# EAGLE board Proto Business Card (EAGLE 7.3.0)
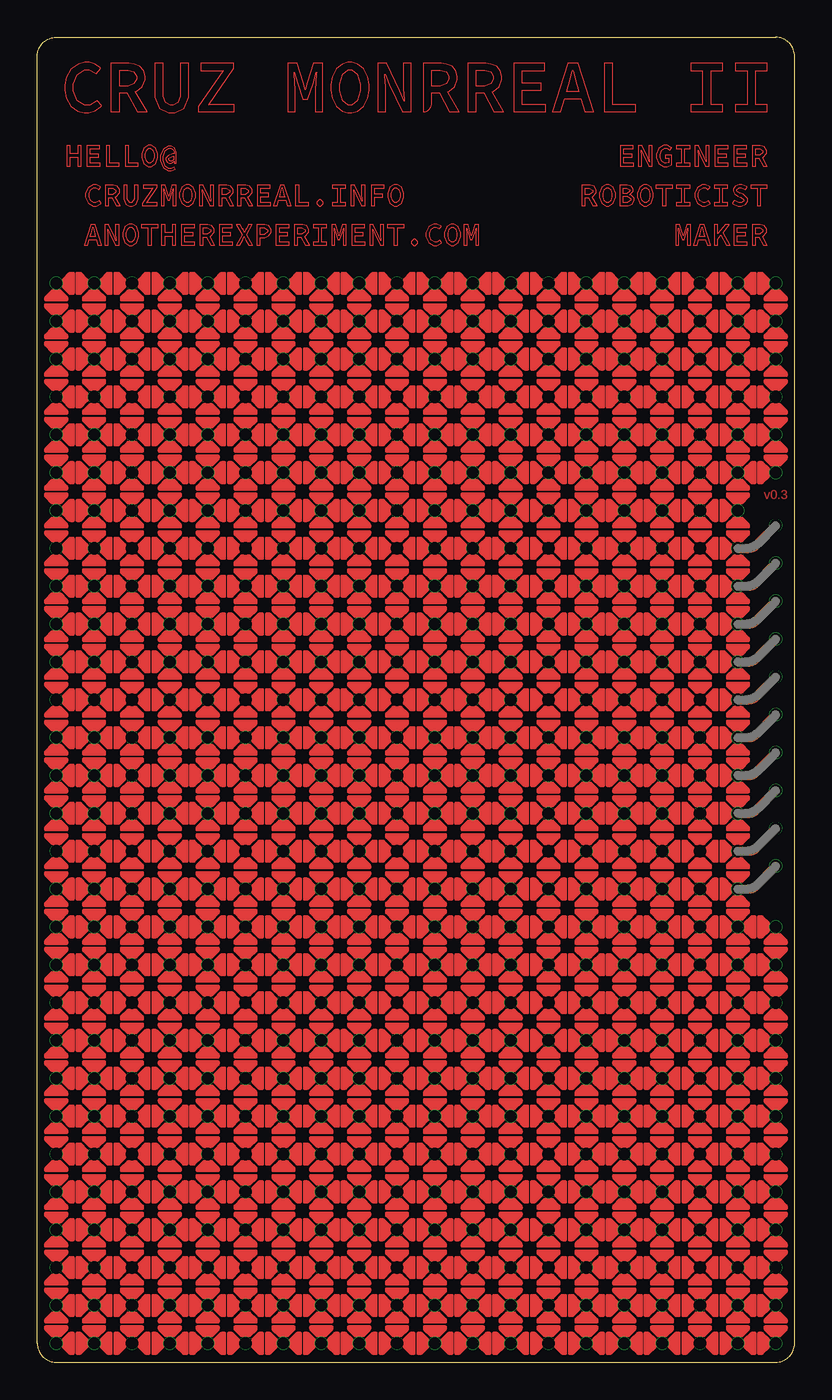
[diagram p1: board, top side]
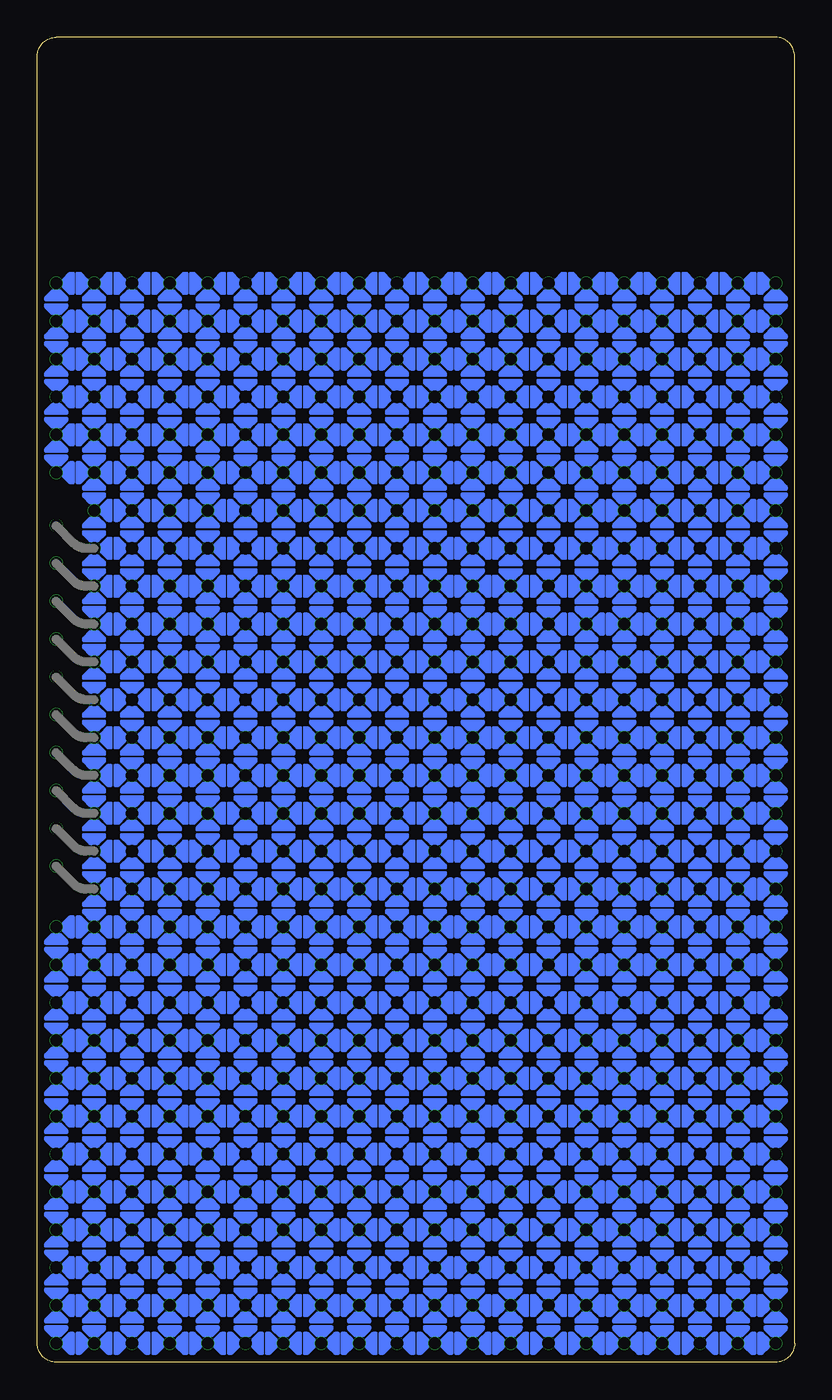
[diagram p2: board, bottom side, seen from below]

Size 50.8 x 88.9 mm. Coordinates in mm from the lower left corner, seen from the top.
Outline: 0,1.27 arc90 1.27,0 49.53,0 arc90 50.8,1.27 50.8,87.63 arc90 49.53,88.9 1.27,88.9 arc90 0,87.63 0,1.27
Copper layers (1*16): Top 0.0356mm / dielectric 1.5011mm / Bottom 0.0356mm
Design rules "OSHPark *": minimum track width 6mil, minimum drill 13mil, track to track 6mil, track to pad 6mil, pad to pad 6mil, via to via 6mil, smd to smd 6mil, copper to edge 15mil, drill to drill 6mil, minimum pad ring 0mil, minimum via ring 0mil, stop-mask expansion 4mil, vias tented up to drill 16mil, thermal gap 10mil

## Footprints (pad centres in the part's own frame; a part is rotated, then mirrored left to right if it is on the bottom)
2-2.CORNER = drill 0.813 pad 0.864: VIA 0,0
3-3 = drill 0.813 pad 0.864: VIA 0,0
4-4 = drill 0.813 pad 0.864: VIA 0,0
NONE = drill 0.813 pad 0.864: VIA 0,0

## Placement (x,y rotation side)
U$1  VIA.2-2.CORNER  [2-2.CORNER]  49.53,72.39 90 top
U$2  VIA.3-3  [3-3]  3.81,72.39 90 top
U$3  VIA.2-2.CORNER  [2-2.CORNER]  1.27,72.39 180 top
U$4  VIA.3-3  [3-3]  1.27,69.85 180 top
U$5  VIA.3-3  [3-3]  1.27,67.31 180 top
U$6  VIA.3-3  [3-3]  1.27,64.77 180 top
U$7  VIA.3-3  [3-3]  1.27,62.23 180 top
U$8  VIA.3-3  [3-3]  1.27,59.69 180 top
U$9  VIA.3-3  [3-3]  1.27,57.15 180 top
U$10  VIA.3-3  [3-3]  1.27,54.61 180 top
U$11  VIA.3-3  [3-3]  1.27,52.07 180 top
U$12  VIA.3-3  [3-3]  1.27,49.53 180 top
U$13  VIA.3-3  [3-3]  1.27,46.99 180 top
U$14  VIA.3-3  [3-3]  1.27,44.45 180 top
U$15  VIA.3-3  [3-3]  1.27,41.91 180 top
U$16  VIA.3-3  [3-3]  1.27,39.37 180 top
U$17  VIA.3-3  [3-3]  1.27,36.83 180 top
U$18  VIA.3-3  [3-3]  1.27,34.29 180 top
U$19  VIA.3-3  [3-3]  1.27,31.75 180 top
U$20  VIA.3-3  [3-3]  49.53,26.67 0 top
U$21  VIA.2-2.CORNER  [2-2.CORNER]  49.53,29.21 90 top
U$22  VIA.3-3  [3-3]  49.53,21.59 0 top
U$23  VIA.3-3  [3-3]  49.53,24.13 0 top
U$24  VIA.3-3  [3-3]  49.53,16.51 0 top
U$25  VIA.3-3  [3-3]  49.53,19.05 0 top
U$26  VIA.3-3  [3-3]  1.27,29.21 180 top
U$27  VIA.3-3  [3-3]  1.27,26.67 180 top
U$28  VIA.3-3  [3-3]  1.27,24.13 180 top
U$29  VIA.3-3  [3-3]  1.27,21.59 180 top
U$30  VIA.3-3  [3-3]  1.27,19.05 180 top
U$31  VIA.3-3  [3-3]  1.27,16.51 180 top
U$32  VIA.3-3  [3-3]  1.27,13.97 180 top
U$33  VIA.3-3  [3-3]  1.27,11.43 180 top
U$34  VIA.3-3  [3-3]  1.27,8.89 180 top
U$35  VIA.3-3  [3-3]  1.27,6.35 180 top
U$36  VIA.3-3  [3-3]  1.27,3.81 180 top
U$37  VIA.2-2.CORNER  [2-2.CORNER]  1.27,1.27 270 top
U$38  VIA.4-4  [4-4]  3.81,69.85 0 top
U$39  VIA.4-4  [4-4]  3.81,67.31 0 top
U$40  VIA.4-4  [4-4]  3.81,64.77 0 top
U$41  VIA.4-4  [4-4]  3.81,62.23 0 top
U$42  VIA.4-4  [4-4]  3.81,59.69 0 top
U$43  VIA.4-4  [4-4]  3.81,57.15 0 top
U$44  VIA.4-4  [4-4]  3.81,54.61 0 top
U$45  VIA.3-3  [3-3]  49.53,11.43 0 top
U$46  VIA.3-3  [3-3]  49.53,13.97 0 top
U$47  VIA.4-4  [4-4]  46.99,26.67 0 top
U$48  VIA.4-4  [4-4]  46.99,29.21 0 top
U$49  VIA.4-4  [4-4]  46.99,21.59 0 top
U$50  VIA.4-4  [4-4]  46.99,24.13 0 top
U$51  VIA.4-4  [4-4]  3.81,52.07 0 top
U$52  VIA.4-4  [4-4]  3.81,49.53 0 top
U$53  VIA.4-4  [4-4]  3.81,46.99 0 top
U$54  VIA.4-4  [4-4]  3.81,44.45 0 top
U$55  VIA.4-4  [4-4]  3.81,41.91 0 top
U$56  VIA.4-4  [4-4]  3.81,39.37 0 top
U$57  VIA.4-4  [4-4]  3.81,36.83 0 top
U$58  VIA.4-4  [4-4]  3.81,34.29 0 top
U$59  VIA.4-4  [4-4]  3.81,31.75 0 top
U$60  VIA.4-4  [4-4]  3.81,29.21 0 top
U$61  VIA.4-4  [4-4]  3.81,26.67 0 top
U$62  VIA.4-4  [4-4]  3.81,24.13 0 top
U$63  VIA.4-4  [4-4]  3.81,21.59 0 top
U$64  VIA.4-4  [4-4]  3.81,19.05 0 top
U$65  VIA.4-4  [4-4]  3.81,16.51 0 top
U$66  VIA.4-4  [4-4]  3.81,13.97 0 top
U$67  VIA.4-4  [4-4]  3.81,11.43 0 top
U$68  VIA.4-4  [4-4]  3.81,8.89 0 top
U$69  VIA.4-4  [4-4]  3.81,6.35 0 top
U$70  VIA.4-4  [4-4]  46.99,16.51 0 top
U$71  VIA.4-4  [4-4]  46.99,19.05 0 top
U$72  VIA.4-4  [4-4]  46.99,11.43 0 top
U$73  VIA.4-4  [4-4]  46.99,13.97 0 top
U$74  VIA.NONE  [NONE]  49.53,48.53 0 top
U$75  VIA.NONE  [NONE]  49.53,51.07 0 top
U$76  VIA.4-4  [4-4]  3.81,3.81 0 top
U$77  VIA.3-3  [3-3]  3.81,1.27 270 top
U$78  VIA.3-3  [3-3]  6.35,72.39 90 top
U$79  VIA.4-4  [4-4]  6.35,69.85 0 top
U$80  VIA.4-4  [4-4]  6.35,67.31 0 top
U$81  VIA.4-4  [4-4]  6.35,64.77 0 top
U$82  VIA.4-4  [4-4]  6.35,62.23 0 top
U$83  VIA.4-4  [4-4]  6.35,59.69 0 top
U$84  VIA.4-4  [4-4]  6.35,57.15 0 top
U$85  VIA.4-4  [4-4]  6.35,54.61 0 top
U$86  VIA.4-4  [4-4]  6.35,52.07 0 top
U$87  VIA.4-4  [4-4]  6.35,49.53 0 top
U$88  VIA.4-4  [4-4]  6.35,46.99 0 top
U$89  VIA.4-4  [4-4]  6.35,44.45 0 top
U$90  VIA.4-4  [4-4]  6.35,41.91 0 top
U$91  VIA.4-4  [4-4]  6.35,39.37 0 top
U$92  VIA.4-4  [4-4]  6.35,36.83 0 top
U$93  VIA.4-4  [4-4]  6.35,34.29 0 top
U$94  VIA.4-4  [4-4]  6.35,31.75 0 top
U$95  VIA.NONE  [NONE]  49.53,43.45 0 top
U$96  VIA.NONE  [NONE]  49.53,45.99 0 top
U$97  VIA.NONE  [NONE]  49.53,38.37 0 top
U$98  VIA.NONE  [NONE]  49.53,40.91 0 top
U$99  VIA.NONE  [NONE]  49.53,33.29 0 top
U$100  VIA.NONE  [NONE]  49.53,35.83 0 top
U$101  VIA.4-4  [4-4]  6.35,29.21 0 top
U$102  VIA.4-4  [4-4]  6.35,26.67 0 top
U$103  VIA.4-4  [4-4]  6.35,24.13 0 top
U$104  VIA.4-4  [4-4]  6.35,21.59 0 top
U$105  VIA.4-4  [4-4]  6.35,19.05 0 top
U$106  VIA.4-4  [4-4]  6.35,16.51 0 top
U$107  VIA.4-4  [4-4]  6.35,13.97 0 top
U$108  VIA.4-4  [4-4]  6.35,11.43 0 top
U$109  VIA.4-4  [4-4]  6.35,8.89 0 top
U$110  VIA.4-4  [4-4]  6.35,6.35 0 top
U$111  VIA.4-4  [4-4]  6.35,3.81 0 top
U$112  VIA.3-3  [3-3]  6.35,1.27 270 top
U$113  VIA.3-3  [3-3]  8.89,72.39 90 top
U$114  VIA.4-4  [4-4]  8.89,69.85 0 top
U$115  VIA.4-4  [4-4]  8.89,67.31 0 top
U$116  VIA.4-4  [4-4]  8.89,64.77 0 top
U$117  VIA.4-4  [4-4]  8.89,62.23 0 top
U$118  VIA.4-4  [4-4]  8.89,59.69 0 top
U$119  VIA.4-4  [4-4]  8.89,57.15 0 top
U$120  VIA.3-3  [3-3]  46.99,46.99 0 top
U$121  VIA.3-3  [3-3]  46.99,49.53 0 top
U$122  VIA.3-3  [3-3]  46.99,41.91 0 top
U$123  VIA.3-3  [3-3]  46.99,44.45 0 top
U$124  VIA.3-3  [3-3]  46.99,36.83 0 top
U$125  VIA.3-3  [3-3]  46.99,39.37 0 top
U$126  VIA.4-4  [4-4]  8.89,54.61 0 top
U$127  VIA.4-4  [4-4]  8.89,52.07 0 top
U$128  VIA.4-4  [4-4]  8.89,49.53 0 top
U$129  VIA.4-4  [4-4]  8.89,46.99 0 top
U$130  VIA.4-4  [4-4]  8.89,44.45 0 top
U$131  VIA.4-4  [4-4]  8.89,41.91 0 top
U$132  VIA.4-4  [4-4]  8.89,39.37 0 top
U$133  VIA.4-4  [4-4]  8.89,36.83 0 top
U$134  VIA.4-4  [4-4]  8.89,34.29 0 top
U$135  VIA.4-4  [4-4]  8.89,31.75 0 top
U$136  VIA.4-4  [4-4]  8.89,29.21 0 top
U$137  VIA.4-4  [4-4]  8.89,26.67 0 top
U$138  VIA.4-4  [4-4]  8.89,24.13 0 top
U$139  VIA.4-4  [4-4]  8.89,21.59 0 top
U$140  VIA.4-4  [4-4]  8.89,19.05 0 top
U$141  VIA.4-4  [4-4]  8.89,16.51 0 top
U$142  VIA.4-4  [4-4]  8.89,13.97 0 top
U$143  VIA.4-4  [4-4]  8.89,11.43 0 top
U$144  VIA.4-4  [4-4]  8.89,8.89 0 top
U$145  VIA.3-3  [3-3]  46.99,31.75 0 top
U$146  VIA.3-3  [3-3]  46.99,34.29 0 top
U$147  VIA.4-4  [4-4]  8.89,6.35 0 top
U$148  VIA.NONE  [NONE]  49.53,53.61 0 top
U$149  VIA.NONE  [NONE]  49.53,56.15 0 top
U$150  VIA.3-3  [3-3]  46.99,52.07 0 top
U$151  VIA.4-4  [4-4]  8.89,3.81 0 top
U$152  VIA.3-3  [3-3]  8.89,1.27 270 top
U$153  VIA.3-3  [3-3]  11.43,72.39 90 top
U$154  VIA.4-4  [4-4]  11.43,69.85 0 top
U$155  VIA.4-4  [4-4]  11.43,67.31 0 top
U$156  VIA.4-4  [4-4]  11.43,64.77 0 top
U$157  VIA.4-4  [4-4]  11.43,62.23 0 top
U$158  VIA.4-4  [4-4]  11.43,59.69 0 top
U$159  VIA.4-4  [4-4]  11.43,57.15 0 top
U$160  VIA.4-4  [4-4]  11.43,54.61 0 top
U$161  VIA.4-4  [4-4]  11.43,52.07 0 top
U$162  VIA.4-4  [4-4]  11.43,49.53 0 top
U$163  VIA.4-4  [4-4]  11.43,46.99 0 top
U$164  VIA.4-4  [4-4]  11.43,44.45 0 top
U$165  VIA.4-4  [4-4]  11.43,41.91 0 top
U$166  VIA.4-4  [4-4]  11.43,39.37 0 top
U$167  VIA.4-4  [4-4]  11.43,36.83 0 top
U$168  VIA.4-4  [4-4]  11.43,34.29 0 top
U$169  VIA.4-4  [4-4]  11.43,31.75 0 top
U$170  VIA.3-3  [3-3]  46.99,54.61 0 top
U$171  VIA.4-4  [4-4]  11.43,29.21 0 top
U$172  VIA.4-4  [4-4]  11.43,26.67 0 top
U$173  VIA.4-4  [4-4]  11.43,24.13 0 top
U$174  VIA.4-4  [4-4]  11.43,21.59 0 top
U$175  VIA.4-4  [4-4]  11.43,19.05 0 top
U$176  VIA.4-4  [4-4]  11.43,16.51 0 top
U$177  VIA.4-4  [4-4]  11.43,13.97 0 top
U$178  VIA.4-4  [4-4]  11.43,11.43 0 top
U$179  VIA.4-4  [4-4]  11.43,8.89 0 top
U$180  VIA.4-4  [4-4]  11.43,6.35 0 top
U$181  VIA.4-4  [4-4]  11.43,3.81 0 top
U$182  VIA.3-3  [3-3]  11.43,1.27 270 top
U$183  VIA.3-3  [3-3]  13.97,72.39 90 top
U$184  VIA.4-4  [4-4]  13.97,69.85 0 top
U$185  VIA.4-4  [4-4]  13.97,67.31 0 top
U$186  VIA.4-4  [4-4]  13.97,64.77 0 top
U$187  VIA.4-4  [4-4]  13.97,62.23 0 top
U$188  VIA.4-4  [4-4]  13.97,59.69 0 top
U$189  VIA.4-4  [4-4]  13.97,57.15 0 top
U$190  VIA.4-4  [4-4]  13.97,54.61 0 top
U$191  VIA.4-4  [4-4]  13.97,52.07 0 top
U$192  VIA.4-4  [4-4]  13.97,49.53 0 top
U$193  VIA.4-4  [4-4]  13.97,46.99 0 top
U$194  VIA.4-4  [4-4]  13.97,44.45 0 top
U$195  VIA.4-4  [4-4]  13.97,41.91 0 top
U$196  VIA.4-4  [4-4]  13.97,39.37 0 top
U$197  VIA.4-4  [4-4]  13.97,36.83 0 top
U$198  VIA.4-4  [4-4]  13.97,34.29 0 top
U$199  VIA.4-4  [4-4]  13.97,31.75 0 top
U$200  VIA.4-4  [4-4]  13.97,29.21 0 top
U$201  VIA.4-4  [4-4]  13.97,26.67 0 top
U$202  VIA.4-4  [4-4]  13.97,24.13 0 top
U$203  VIA.4-4  [4-4]  13.97,21.59 0 top
U$204  VIA.4-4  [4-4]  13.97,19.05 0 top
U$205  VIA.4-4  [4-4]  13.97,16.51 0 top
U$206  VIA.4-4  [4-4]  13.97,13.97 0 top
U$207  VIA.4-4  [4-4]  13.97,11.43 0 top
U$208  VIA.4-4  [4-4]  13.97,8.89 0 top
U$209  VIA.4-4  [4-4]  13.97,6.35 0 top
U$210  VIA.4-4  [4-4]  13.97,3.81 0 top
U$211  VIA.3-3  [3-3]  13.97,1.27 270 top
U$212  VIA.3-3  [3-3]  16.51,72.39 90 top
U$213  VIA.4-4  [4-4]  16.51,69.85 0 top
U$214  VIA.4-4  [4-4]  16.51,67.31 0 top
U$215  VIA.4-4  [4-4]  16.51,64.77 0 top
U$216  VIA.4-4  [4-4]  16.51,62.23 0 top
U$217  VIA.4-4  [4-4]  16.51,59.69 0 top
U$218  VIA.4-4  [4-4]  16.51,57.15 0 top
U$219  VIA.4-4  [4-4]  16.51,54.61 0 top
U$220  VIA.4-4  [4-4]  16.51,52.07 0 top
U$221  VIA.4-4  [4-4]  16.51,49.53 0 top
U$222  VIA.4-4  [4-4]  16.51,46.99 0 top
U$223  VIA.4-4  [4-4]  16.51,44.45 0 top
U$224  VIA.4-4  [4-4]  16.51,41.91 0 top
U$225  VIA.4-4  [4-4]  16.51,39.37 0 top
U$226  VIA.4-4  [4-4]  16.51,36.83 0 top
U$227  VIA.4-4  [4-4]  16.51,34.29 0 top
U$228  VIA.4-4  [4-4]  16.51,31.75 0 top
U$229  VIA.4-4  [4-4]  16.51,29.21 0 top
U$230  VIA.4-4  [4-4]  16.51,26.67 0 top
U$231  VIA.4-4  [4-4]  16.51,24.13 0 top
U$232  VIA.4-4  [4-4]  16.51,21.59 0 top
U$233  VIA.4-4  [4-4]  16.51,19.05 0 top
U$234  VIA.4-4  [4-4]  16.51,16.51 0 top
U$235  VIA.4-4  [4-4]  16.51,13.97 0 top
U$236  VIA.4-4  [4-4]  16.51,11.43 0 top
U$237  VIA.4-4  [4-4]  16.51,8.89 0 top
U$238  VIA.4-4  [4-4]  16.51,6.35 0 top
U$239  VIA.4-4  [4-4]  16.51,3.81 0 top
U$240  VIA.3-3  [3-3]  16.51,1.27 270 top
U$241  VIA.3-3  [3-3]  19.05,72.39 90 top
U$242  VIA.4-4  [4-4]  19.05,69.85 0 top
U$243  VIA.4-4  [4-4]  19.05,67.31 0 top
U$244  VIA.4-4  [4-4]  19.05,64.77 0 top
U$245  VIA.4-4  [4-4]  19.05,62.23 0 top
U$246  VIA.4-4  [4-4]  19.05,59.69 0 top
U$247  VIA.4-4  [4-4]  19.05,57.15 0 top
U$248  VIA.4-4  [4-4]  19.05,54.61 0 top
U$249  VIA.4-4  [4-4]  19.05,52.07 0 top
U$250  VIA.4-4  [4-4]  19.05,49.53 0 top
U$251  VIA.4-4  [4-4]  19.05,46.99 0 top
U$252  VIA.4-4  [4-4]  19.05,44.45 0 top
U$253  VIA.4-4  [4-4]  19.05,41.91 0 top
U$254  VIA.4-4  [4-4]  19.05,39.37 0 top
U$255  VIA.4-4  [4-4]  19.05,36.83 0 top
U$256  VIA.4-4  [4-4]  19.05,34.29 0 top
U$257  VIA.4-4  [4-4]  19.05,31.75 0 top
U$258  VIA.4-4  [4-4]  19.05,29.21 0 top
U$259  VIA.4-4  [4-4]  19.05,26.67 0 top
U$260  VIA.4-4  [4-4]  19.05,24.13 0 top
U$261  VIA.4-4  [4-4]  19.05,21.59 0 top
U$262  VIA.4-4  [4-4]  19.05,19.05 0 top
U$263  VIA.4-4  [4-4]  19.05,16.51 0 top
U$264  VIA.4-4  [4-4]  19.05,13.97 0 top
U$265  VIA.4-4  [4-4]  19.05,11.43 0 top
U$266  VIA.4-4  [4-4]  19.05,8.89 0 top
U$267  VIA.4-4  [4-4]  19.05,6.35 0 top
U$268  VIA.4-4  [4-4]  19.05,3.81 0 top
U$269  VIA.3-3  [3-3]  19.05,1.27 270 top
U$270  VIA.3-3  [3-3]  21.59,72.39 90 top
U$271  VIA.4-4  [4-4]  21.59,69.85 0 top
U$272  VIA.4-4  [4-4]  21.59,67.31 0 top
U$273  VIA.4-4  [4-4]  21.59,64.77 0 top
U$274  VIA.4-4  [4-4]  21.59,62.23 0 top
U$275  VIA.4-4  [4-4]  21.59,59.69 0 top
U$276  VIA.4-4  [4-4]  21.59,57.15 0 top
U$277  VIA.4-4  [4-4]  21.59,54.61 0 top
U$278  VIA.4-4  [4-4]  21.59,52.07 0 top
U$279  VIA.4-4  [4-4]  21.59,49.53 0 top
U$280  VIA.4-4  [4-4]  21.59,46.99 0 top
U$281  VIA.4-4  [4-4]  21.59,44.45 0 top
U$282  VIA.4-4  [4-4]  21.59,41.91 0 top
U$283  VIA.4-4  [4-4]  21.59,39.37 0 top
U$284  VIA.4-4  [4-4]  21.59,36.83 0 top
U$285  VIA.4-4  [4-4]  21.59,34.29 0 top
U$286  VIA.4-4  [4-4]  21.59,31.75 0 top
U$287  VIA.4-4  [4-4]  21.59,29.21 0 top
U$288  VIA.4-4  [4-4]  21.59,26.67 0 top
U$289  VIA.4-4  [4-4]  21.59,24.13 0 top
U$290  VIA.4-4  [4-4]  21.59,21.59 0 top
U$291  VIA.4-4  [4-4]  21.59,19.05 0 top
U$292  VIA.4-4  [4-4]  21.59,16.51 0 top
U$293  VIA.4-4  [4-4]  21.59,13.97 0 top
U$294  VIA.4-4  [4-4]  21.59,11.43 0 top
U$295  VIA.4-4  [4-4]  21.59,8.89 0 top
U$296  VIA.4-4  [4-4]  21.59,6.35 0 top
U$297  VIA.4-4  [4-4]  21.59,3.81 0 top
U$298  VIA.3-3  [3-3]  21.59,1.27 270 top
U$299  VIA.3-3  [3-3]  24.13,72.39 90 top
U$300  VIA.4-4  [4-4]  24.13,69.85 0 top
U$301  VIA.4-4  [4-4]  24.13,67.31 0 top
U$302  VIA.4-4  [4-4]  24.13,64.77 0 top
U$303  VIA.4-4  [4-4]  24.13,62.23 0 top
U$304  VIA.4-4  [4-4]  24.13,59.69 0 top
U$305  VIA.4-4  [4-4]  24.13,57.15 0 top
U$306  VIA.4-4  [4-4]  24.13,54.61 0 top
U$307  VIA.4-4  [4-4]  24.13,52.07 0 top
U$308  VIA.4-4  [4-4]  24.13,49.53 0 top
U$309  VIA.4-4  [4-4]  24.13,46.99 0 top
U$310  VIA.4-4  [4-4]  24.13,44.45 0 top
U$311  VIA.4-4  [4-4]  24.13,41.91 0 top
U$312  VIA.4-4  [4-4]  24.13,39.37 0 top
U$313  VIA.4-4  [4-4]  24.13,36.83 0 top
U$314  VIA.4-4  [4-4]  24.13,34.29 0 top
U$315  VIA.4-4  [4-4]  24.13,31.75 0 top
U$316  VIA.4-4  [4-4]  24.13,29.21 0 top
U$317  VIA.4-4  [4-4]  24.13,26.67 0 top
U$318  VIA.4-4  [4-4]  24.13,24.13 0 top
U$319  VIA.4-4  [4-4]  24.13,21.59 0 top
U$320  VIA.4-4  [4-4]  24.13,19.05 0 top
U$321  VIA.4-4  [4-4]  24.13,16.51 0 top
U$322  VIA.4-4  [4-4]  24.13,13.97 0 top
U$323  VIA.4-4  [4-4]  24.13,11.43 0 top
U$324  VIA.4-4  [4-4]  24.13,8.89 0 top
U$325  VIA.4-4  [4-4]  24.13,6.35 0 top
U$326  VIA.4-4  [4-4]  24.13,3.81 0 top
U$327  VIA.3-3  [3-3]  24.13,1.27 270 top
U$328  VIA.3-3  [3-3]  26.67,72.39 90 top
U$329  VIA.4-4  [4-4]  26.67,69.85 0 top
U$330  VIA.4-4  [4-4]  26.67,67.31 0 top
U$331  VIA.4-4  [4-4]  26.67,64.77 0 top
U$332  VIA.4-4  [4-4]  26.67,62.23 0 top
U$333  VIA.4-4  [4-4]  26.67,59.69 0 top
U$334  VIA.4-4  [4-4]  26.67,57.15 0 top
U$335  VIA.4-4  [4-4]  26.67,54.61 0 top
U$336  VIA.4-4  [4-4]  26.67,52.07 0 top
U$337  VIA.4-4  [4-4]  26.67,49.53 0 top
U$338  VIA.4-4  [4-4]  26.67,46.99 0 top
U$339  VIA.4-4  [4-4]  26.67,44.45 0 top
U$340  VIA.4-4  [4-4]  26.67,41.91 0 top
U$341  VIA.4-4  [4-4]  26.67,39.37 0 top
U$342  VIA.4-4  [4-4]  26.67,36.83 0 top
U$343  VIA.4-4  [4-4]  26.67,34.29 0 top
U$344  VIA.4-4  [4-4]  26.67,31.75 0 top
U$345  VIA.4-4  [4-4]  26.67,29.21 0 top
U$346  VIA.4-4  [4-4]  26.67,26.67 0 top
U$347  VIA.4-4  [4-4]  26.67,24.13 0 top
U$348  VIA.4-4  [4-4]  26.67,21.59 0 top
U$349  VIA.4-4  [4-4]  26.67,19.05 0 top
U$350  VIA.4-4  [4-4]  26.67,16.51 0 top
U$351  VIA.4-4  [4-4]  26.67,13.97 0 top
U$352  VIA.4-4  [4-4]  26.67,11.43 0 top
U$353  VIA.4-4  [4-4]  26.67,8.89 0 top
U$354  VIA.4-4  [4-4]  26.67,6.35 0 top
U$355  VIA.4-4  [4-4]  26.67,3.81 0 top
U$356  VIA.3-3  [3-3]  26.67,1.27 270 top
U$357  VIA.3-3  [3-3]  29.21,72.39 90 top
U$358  VIA.4-4  [4-4]  29.21,69.85 0 top
U$359  VIA.4-4  [4-4]  29.21,67.31 0 top
U$360  VIA.4-4  [4-4]  29.21,64.77 0 top
U$361  VIA.4-4  [4-4]  29.21,62.23 0 top
U$362  VIA.4-4  [4-4]  29.21,59.69 0 top
U$363  VIA.4-4  [4-4]  29.21,57.15 0 top
U$364  VIA.4-4  [4-4]  29.21,54.61 0 top
U$365  VIA.4-4  [4-4]  29.21,52.07 0 top
U$366  VIA.4-4  [4-4]  29.21,49.53 0 top
U$367  VIA.4-4  [4-4]  29.21,46.99 0 top
U$368  VIA.4-4  [4-4]  29.21,44.45 0 top
U$369  VIA.4-4  [4-4]  29.21,41.91 0 top
U$370  VIA.4-4  [4-4]  29.21,39.37 0 top
U$371  VIA.4-4  [4-4]  29.21,36.83 0 top
U$372  VIA.4-4  [4-4]  29.21,34.29 0 top
U$373  VIA.4-4  [4-4]  29.21,31.75 0 top
U$374  VIA.4-4  [4-4]  29.21,29.21 0 top
U$375  VIA.4-4  [4-4]  29.21,26.67 0 top
U$376  VIA.4-4  [4-4]  29.21,24.13 0 top
U$377  VIA.4-4  [4-4]  29.21,21.59 0 top
U$378  VIA.4-4  [4-4]  29.21,19.05 0 top
U$379  VIA.4-4  [4-4]  29.21,16.51 0 top
U$380  VIA.4-4  [4-4]  29.21,13.97 0 top
U$381  VIA.4-4  [4-4]  29.21,11.43 0 top
U$382  VIA.4-4  [4-4]  29.21,8.89 0 top
U$383  VIA.4-4  [4-4]  29.21,6.35 0 top
U$384  VIA.4-4  [4-4]  29.21,3.81 0 top
U$385  VIA.3-3  [3-3]  29.21,1.27 270 top
U$386  VIA.3-3  [3-3]  31.75,72.39 90 top
U$387  VIA.4-4  [4-4]  31.75,69.85 0 top
U$388  VIA.4-4  [4-4]  31.75,67.31 0 top
U$389  VIA.4-4  [4-4]  31.75,64.77 0 top
U$390  VIA.4-4  [4-4]  31.75,62.23 0 top
U$391  VIA.4-4  [4-4]  31.75,59.69 0 top
U$392  VIA.4-4  [4-4]  31.75,57.15 0 top
U$393  VIA.4-4  [4-4]  31.75,54.61 0 top
U$394  VIA.4-4  [4-4]  31.75,52.07 0 top
U$395  VIA.4-4  [4-4]  31.75,49.53 0 top
U$396  VIA.4-4  [4-4]  31.75,46.99 0 top
U$397  VIA.4-4  [4-4]  31.75,44.45 0 top
U$398  VIA.4-4  [4-4]  31.75,41.91 0 top
U$399  VIA.4-4  [4-4]  31.75,39.37 0 top
U$400  VIA.4-4  [4-4]  31.75,36.83 0 top
U$401  VIA.4-4  [4-4]  31.75,34.29 0 top
U$402  VIA.4-4  [4-4]  31.75,31.75 0 top
U$403  VIA.4-4  [4-4]  31.75,29.21 0 top
U$404  VIA.4-4  [4-4]  31.75,26.67 0 top
U$405  VIA.4-4  [4-4]  31.75,24.13 0 top
U$406  VIA.4-4  [4-4]  31.75,21.59 0 top
U$407  VIA.4-4  [4-4]  31.75,19.05 0 top
U$408  VIA.4-4  [4-4]  31.75,16.51 0 top
U$409  VIA.4-4  [4-4]  31.75,13.97 0 top
U$410  VIA.4-4  [4-4]  31.75,11.43 0 top
U$411  VIA.4-4  [4-4]  31.75,8.89 0 top
U$412  VIA.4-4  [4-4]  31.75,6.35 0 top
U$413  VIA.4-4  [4-4]  31.75,3.81 0 top
U$414  VIA.3-3  [3-3]  31.75,1.27 270 top
U$415  VIA.3-3  [3-3]  34.29,72.39 90 top
U$416  VIA.4-4  [4-4]  34.29,69.85 0 top
U$417  VIA.4-4  [4-4]  34.29,67.31 0 top
U$418  VIA.4-4  [4-4]  34.29,64.77 0 top
U$419  VIA.4-4  [4-4]  34.29,62.23 0 top
U$420  VIA.4-4  [4-4]  34.29,59.69 0 top
U$421  VIA.4-4  [4-4]  34.29,57.15 0 top
U$422  VIA.4-4  [4-4]  34.29,54.61 0 top
U$423  VIA.4-4  [4-4]  34.29,52.07 0 top
U$424  VIA.4-4  [4-4]  34.29,49.53 0 top
U$425  VIA.4-4  [4-4]  34.29,46.99 0 top
U$426  VIA.4-4  [4-4]  34.29,44.45 0 top
U$427  VIA.4-4  [4-4]  34.29,41.91 0 top
U$428  VIA.4-4  [4-4]  34.29,39.37 0 top
U$429  VIA.4-4  [4-4]  34.29,36.83 0 top
U$430  VIA.4-4  [4-4]  34.29,34.29 0 top
U$431  VIA.4-4  [4-4]  34.29,31.75 0 top
U$432  VIA.4-4  [4-4]  34.29,29.21 0 top
U$433  VIA.4-4  [4-4]  34.29,26.67 0 top
U$434  VIA.4-4  [4-4]  34.29,24.13 0 top
U$435  VIA.4-4  [4-4]  34.29,21.59 0 top
U$436  VIA.4-4  [4-4]  34.29,19.05 0 top
U$437  VIA.4-4  [4-4]  34.29,16.51 0 top
U$438  VIA.4-4  [4-4]  34.29,13.97 0 top
U$439  VIA.4-4  [4-4]  34.29,11.43 0 top
U$440  VIA.4-4  [4-4]  34.29,8.89 0 top
U$441  VIA.4-4  [4-4]  34.29,6.35 0 top
U$442  VIA.4-4  [4-4]  34.29,3.81 0 top
U$443  VIA.3-3  [3-3]  34.29,1.27 270 top
U$444  VIA.3-3  [3-3]  36.83,72.39 90 top
U$445  VIA.4-4  [4-4]  36.83,69.85 0 top
U$446  VIA.4-4  [4-4]  36.83,67.31 0 top
U$447  VIA.4-4  [4-4]  36.83,64.77 0 top
U$448  VIA.4-4  [4-4]  36.83,62.23 0 top
U$449  VIA.4-4  [4-4]  36.83,59.69 0 top
U$450  VIA.4-4  [4-4]  36.83,57.15 0 top
U$451  VIA.4-4  [4-4]  36.83,54.61 0 top
U$452  VIA.4-4  [4-4]  36.83,52.07 0 top
U$453  VIA.4-4  [4-4]  36.83,49.53 0 top
U$454  VIA.4-4  [4-4]  36.83,46.99 0 top
U$455  VIA.4-4  [4-4]  36.83,44.45 0 top
U$456  VIA.4-4  [4-4]  36.83,41.91 0 top
U$457  VIA.4-4  [4-4]  36.83,39.37 0 top
U$458  VIA.4-4  [4-4]  36.83,36.83 0 top
U$459  VIA.4-4  [4-4]  36.83,34.29 0 top
U$460  VIA.4-4  [4-4]  36.83,31.75 0 top
U$461  VIA.4-4  [4-4]  36.83,29.21 0 top
U$462  VIA.4-4  [4-4]  36.83,26.67 0 top
U$463  VIA.4-4  [4-4]  36.83,24.13 0 top
U$464  VIA.4-4  [4-4]  36.83,21.59 0 top
U$465  VIA.4-4  [4-4]  36.83,19.05 0 top
U$466  VIA.4-4  [4-4]  36.83,16.51 0 top
U$467  VIA.4-4  [4-4]  36.83,13.97 0 top
U$468  VIA.4-4  [4-4]  36.83,11.43 0 top
U$469  VIA.4-4  [4-4]  36.83,8.89 0 top
U$470  VIA.4-4  [4-4]  36.83,6.35 0 top
U$471  VIA.4-4  [4-4]  36.83,3.81 0 top
U$472  VIA.3-3  [3-3]  36.83,1.27 270 top
U$473  VIA.3-3  [3-3]  39.37,72.39 90 top
U$474  VIA.4-4  [4-4]  39.37,69.85 0 top
U$475  VIA.4-4  [4-4]  39.37,67.31 0 top
U$476  VIA.4-4  [4-4]  39.37,64.77 0 top
U$477  VIA.4-4  [4-4]  39.37,62.23 0 top
U$478  VIA.4-4  [4-4]  39.37,59.69 0 top
U$479  VIA.4-4  [4-4]  39.37,57.15 0 top
U$480  VIA.4-4  [4-4]  39.37,54.61 0 top
U$481  VIA.4-4  [4-4]  39.37,52.07 0 top
U$482  VIA.4-4  [4-4]  39.37,49.53 0 top
U$483  VIA.4-4  [4-4]  39.37,46.99 0 top
U$484  VIA.4-4  [4-4]  39.37,44.45 0 top
U$485  VIA.4-4  [4-4]  39.37,41.91 0 top
U$486  VIA.4-4  [4-4]  39.37,39.37 0 top
U$487  VIA.4-4  [4-4]  39.37,36.83 0 top
U$488  VIA.4-4  [4-4]  39.37,34.29 0 top
U$489  VIA.4-4  [4-4]  39.37,31.75 0 top
U$490  VIA.4-4  [4-4]  39.37,29.21 0 top
U$491  VIA.4-4  [4-4]  39.37,26.67 0 top
U$492  VIA.4-4  [4-4]  39.37,24.13 0 top
U$493  VIA.4-4  [4-4]  39.37,21.59 0 top
U$494  VIA.4-4  [4-4]  39.37,19.05 0 top
U$495  VIA.4-4  [4-4]  39.37,16.51 0 top
U$496  VIA.4-4  [4-4]  39.37,13.97 0 top
U$497  VIA.4-4  [4-4]  39.37,11.43 0 top
U$498  VIA.4-4  [4-4]  39.37,8.89 0 top
U$499  VIA.4-4  [4-4]  39.37,6.35 0 top
U$500  VIA.4-4  [4-4]  39.37,3.81 0 top
U$501  VIA.3-3  [3-3]  39.37,1.27 270 top
U$502  VIA.3-3  [3-3]  41.91,72.39 90 top
U$503  VIA.4-4  [4-4]  41.91,69.85 0 top
U$504  VIA.4-4  [4-4]  41.91,67.31 0 top
U$505  VIA.4-4  [4-4]  41.91,64.77 0 top
U$506  VIA.4-4  [4-4]  41.91,62.23 0 top
U$507  VIA.4-4  [4-4]  41.91,59.69 0 top
U$508  VIA.4-4  [4-4]  41.91,57.15 0 top
U$509  VIA.4-4  [4-4]  41.91,54.61 0 top
U$510  VIA.4-4  [4-4]  41.91,52.07 0 top
U$511  VIA.4-4  [4-4]  41.91,49.53 0 top
U$512  VIA.4-4  [4-4]  41.91,46.99 0 top
U$513  VIA.4-4  [4-4]  41.91,44.45 0 top
U$514  VIA.4-4  [4-4]  41.91,41.91 0 top
U$515  VIA.4-4  [4-4]  41.91,39.37 0 top
U$516  VIA.4-4  [4-4]  41.91,36.83 0 top
U$517  VIA.4-4  [4-4]  41.91,34.29 0 top
U$518  VIA.4-4  [4-4]  41.91,31.75 0 top
U$519  VIA.4-4  [4-4]  41.91,29.21 0 top
U$520  VIA.4-4  [4-4]  41.91,26.67 0 top
U$521  VIA.4-4  [4-4]  41.91,24.13 0 top
U$522  VIA.4-4  [4-4]  41.91,21.59 0 top
U$523  VIA.4-4  [4-4]  41.91,19.05 0 top
U$524  VIA.4-4  [4-4]  41.91,16.51 0 top
U$525  VIA.4-4  [4-4]  41.91,13.97 0 top
U$526  VIA.4-4  [4-4]  41.91,11.43 0 top
U$527  VIA.4-4  [4-4]  41.91,8.89 0 top
U$528  VIA.4-4  [4-4]  41.91,6.35 0 top
U$529  VIA.4-4  [4-4]  41.91,3.81 0 top
U$530  VIA.3-3  [3-3]  41.91,1.27 270 top
U$531  VIA.3-3  [3-3]  44.45,72.39 90 top
U$532  VIA.4-4  [4-4]  44.45,69.85 0 top
U$533  VIA.4-4  [4-4]  44.45,67.31 0 top
U$534  VIA.4-4  [4-4]  44.45,64.77 0 top
U$535  VIA.4-4  [4-4]  44.45,62.23 0 top
U$536  VIA.4-4  [4-4]  44.45,59.69 0 top
U$537  VIA.4-4  [4-4]  44.45,57.15 0 top
U$538  VIA.4-4  [4-4]  44.45,54.61 0 top
U$539  VIA.4-4  [4-4]  44.45,52.07 0 top
U$540  VIA.4-4  [4-4]  44.45,49.53 0 top
U$541  VIA.4-4  [4-4]  44.45,46.99 0 top
U$542  VIA.4-4  [4-4]  44.45,44.45 0 top
U$543  VIA.4-4  [4-4]  44.45,41.91 0 top
U$544  VIA.4-4  [4-4]  44.45,39.37 0 top
U$545  VIA.4-4  [4-4]  44.45,36.83 0 top
U$546  VIA.4-4  [4-4]  44.45,34.29 0 top
U$547  VIA.4-4  [4-4]  44.45,31.75 0 top
U$548  VIA.4-4  [4-4]  44.45,29.21 0 top
U$549  VIA.4-4  [4-4]  44.45,26.67 0 top
U$550  VIA.4-4  [4-4]  44.45,24.13 0 top
U$551  VIA.4-4  [4-4]  44.45,21.59 0 top
U$552  VIA.4-4  [4-4]  44.45,19.05 0 top
U$553  VIA.4-4  [4-4]  44.45,16.51 0 top
U$554  VIA.4-4  [4-4]  44.45,13.97 0 top
U$555  VIA.4-4  [4-4]  44.45,11.43 0 top
U$556  VIA.4-4  [4-4]  44.45,8.89 0 top
U$557  VIA.4-4  [4-4]  44.45,6.35 0 top
U$558  VIA.4-4  [4-4]  44.45,3.81 0 top
U$559  VIA.3-3  [3-3]  44.45,1.27 270 top
U$560  VIA.3-3  [3-3]  46.99,72.39 90 top
U$561  VIA.4-4  [4-4]  46.99,69.85 0 top
U$562  VIA.4-4  [4-4]  46.99,67.31 0 top
U$563  VIA.4-4  [4-4]  46.99,64.77 0 top
U$564  VIA.4-4  [4-4]  46.99,62.23 0 top
U$565  VIA.4-4  [4-4]  46.99,59.69 0 top
U$566  VIA.3-3  [3-3]  49.53,69.85 0 top
U$567  VIA.3-3  [3-3]  49.53,67.31 0 top
U$568  VIA.3-3  [3-3]  49.53,64.77 0 top
U$569  VIA.3-3  [3-3]  49.53,62.23 0 top
U$570  VIA.2-2.CORNER  [2-2.CORNER]  49.53,59.69 0 top
U$571  VIA.3-3  [3-3]  49.53,8.89 0 top
U$572  VIA.3-3  [3-3]  49.53,6.35 0 top
U$573  VIA.3-3  [3-3]  49.53,3.81 0 top
U$574  VIA.2-2.CORNER  [2-2.CORNER]  49.53,1.27 0 top
U$575  VIA.3-3  [3-3]  46.99,57.15 0 top
U$585  VIA.4-4  [4-4]  46.99,8.89 0 top
U$586  VIA.4-4  [4-4]  46.99,6.35 0 top
U$587  VIA.4-4  [4-4]  46.99,3.81 0 top
U$588  VIA.3-3  [3-3]  46.99,1.27 270 top

## Tracks (layer width: path | path; a pad name or v marks a point on that pad's centre or on a via)
N$1
  Top 0.61: U$145.VIA 47.73,31.75 arc45 48.18,31.94 U$99.VIA
N$2
  Top 0.61: U$146.VIA 47.73,34.29 arc45 48.18,34.48 U$100.VIA
N$3
  Top 0.61: U$124.VIA 47.73,36.83 arc45 48.18,37.02 U$97.VIA
N$4
  Top 0.61: U$125.VIA 47.73,39.37 arc45 48.18,39.56 U$98.VIA
N$5
  Top 0.61: U$122.VIA 47.73,41.91 arc45 48.18,42.1 U$95.VIA
N$6
  Top 0.61: U$123.VIA 47.73,44.45 arc45 48.18,44.64 U$96.VIA
N$7
  Top 0.61: U$120.VIA 47.73,46.99 arc45 48.18,47.18 U$74.VIA
N$8
  Top 0.61: U$121.VIA 47.73,49.53 arc45 48.18,49.72 U$75.VIA
N$9
  Top 0.61: U$150.VIA 47.73,52.07 arc45 48.18,52.26 U$148.VIA
N$10
  Top 0.61: U$170.VIA 47.73,54.61 arc45 48.18,54.8 U$149.VIA
N$11
  Top 0.025: 3.15,83.83 3.44,83.83 3.88,83.95 4.27,84.23 4.34,84.31 4.02,84.66 3.97,84.61 3.5,84.34 3.18,84.34 2.68,84.66 2.42,85.31 2.42,85.75 2.68,86.39 3.17,86.71 3.49,86.71 3.91,86.48 3.95,86.44 4.27,86.81 4.22,86.86 3.88,87.09 3.47,87.22 3.19,87.22 2.74,87.1 2.26,86.77 1.94,86.23 1.83,85.69 1.83,85.33 1.94,84.8 2.26,84.27 2.73,83.94 3.15,83.83
N$12
  Top 0.025: 4.94,83.89 5.52,83.89 5.52,85.17 6.01,85.17 6.7,83.89 7.36,83.89 6.58,85.25 6.68,85.29 7.05,85.59 7.23,86.04 7.23,86.3 7.13,86.64 6.88,86.94 6.5,87.11 6.14,87.16 4.94,87.16 4.94,83.89
N$13
  Top 0.025: 5.52,85.63 5.52,86.69 6.09,86.69 6.48,86.58 6.66,86.28 6.66,86.08 6.48,85.77 6.09,85.63 5.52,85.63
N$14
  Top 0.025: 9.22,83.83 9.85,84.15 10.15,84.89 10.15,87.16 9.59,87.16 9.59,84.95 9.44,84.52 9.12,84.34 8.91,84.34 8.6,84.52 8.45,84.95 8.45,87.16 7.87,87.16 7.87,84.89 8.18,84.15 8.8,83.83 9.22,83.83
N$15
  Top 0.025: 10.81,83.89 13.21,83.89 13.21,84.38 11.52,84.38 13.19,86.81 13.19,87.16 10.96,87.16 10.96,86.67 12.48,86.67 10.81,84.24 10.81,83.89
N$16
  Top 0.025: 16.81,83.89 17.31,83.89 17.31,85.38 17.28,85.89 17.23,86.47 17.22,86.54 17.24,86.54 17.46,85.79 17.81,84.76 18.14,84.76 18.5,85.79 18.72,86.54 18.73,86.54 18.72,86.47 18.68,85.89 18.65,85.38 18.65,83.89 19.15,83.89 19.15,87.16 18.51,87.16 18.12,85.88 17.99,85.39 17.97,85.39 17.84,85.88 17.45,87.16 16.81,87.16 16.81,83.89
N$17
  Top 0.025: 21.1,83.83 21.49,83.94 21.9,84.28 22.16,84.81 22.25,85.36 22.25,85.72 22.16,86.25 21.9,86.78 21.49,87.11 21.1,87.22 20.84,87.22 20.45,87.11 20.05,86.78 19.78,86.25 19.69,85.72 19.69,85.36 19.78,84.81 20.05,84.28 20.45,83.94 20.84,83.83 21.1,83.83
N$18
  Top 0.025: 20.85,84.34 20.47,84.65 20.29,85.32 20.29,85.76 20.47,86.4 20.85,86.71 21.1,86.71 21.47,86.4 21.66,85.76 21.66,85.32 21.47,84.65 21.1,84.34 20.85,84.34
N$19
  Top 0.025: 22.84,83.89 23.39,83.89 23.39,85.59 23.32,86.33 23.31,86.42 23.33,86.42 23.62,85.73 24.48,83.89 25.09,83.89 25.09,87.16 24.54,87.16 24.54,85.46 24.61,84.71 24.62,84.62 24.6,84.62 24.31,85.33 23.44,87.16 22.84,87.16 22.84,83.89
N$20
  Top 0.025: 25.88,83.89 arc90 26.46,84.47 26.46,85.17 26.95,85.17 27.64,83.89 28.3,83.89 27.52,85.25 27.62,85.29 27.99,85.59 28.17,86.04 28.17,86.3 28.07,86.64 27.82,86.94 27.44,87.11 27.08,87.16 25.88,87.16 25.88,83.89
N$21
  Top 0.025: 26.46,85.63 26.46,86.69 27.03,86.69 27.42,86.58 27.6,86.28 27.6,86.08 27.42,85.77 27.03,85.63 26.46,85.63
N$22
  Top 0.025: 28.87,83.89 29.45,83.89 29.45,85.17 29.94,85.17 30.63,83.89 31.29,83.89 30.51,85.25 30.61,85.29 30.98,85.59 31.16,86.04 31.16,86.3 31.06,86.64 30.81,86.94 30.43,87.11 30.07,87.16 28.87,87.16 28.87,83.89
N$23
  Top 0.025: 29.45,85.63 29.45,86.69 30.02,86.69 30.41,86.58 30.59,86.28 30.59,86.08 30.41,85.77 30.02,85.63 29.45,85.63
N$24
  Top 0.025: 31.95,83.89 34.09,83.89 34.09,84.38 32.53,84.38 32.53,85.34 33.82,85.34 33.82,85.83 32.53,85.83 32.53,86.67 34.04,86.67 34.04,87.16 31.95,87.16 31.95,83.89
N$25
  Top 0.025: 35.62,85.63 35.64,85.71 35.89,86.61 35.91,86.7 35.93,86.7 35.95,86.61 36.19,85.71 36.22,85.63 36.33,85.23 35.51,85.23 35.62,85.63
N$26
  Top 0.025: 34.53,83.89 35.12,83.89 35.37,84.77 36.46,84.77 36.71,83.89 37.33,83.89 36.27,87.16 35.59,87.16 34.53,83.89
N$27
  Top 0.025: 38.02,83.89 40.13,83.89 40.13,84.38 38.6,84.38 38.6,87.16 38.02,87.16 38.02,83.89
N$28
  Top 0.025: 43.82,83.89 45.98,83.89 45.98,84.38 45.19,84.38 45.19,86.67 45.98,86.67 45.98,87.16 43.82,87.16 43.82,86.67 44.61,86.67 44.61,84.38 43.82,84.38 43.82,83.89
N$29
  Top 0.025: 46.81,83.89 48.97,83.89 48.97,84.38 48.18,84.38 48.18,86.67 48.97,86.67 48.97,87.16 46.81,87.16 46.81,86.67 47.6,86.67 47.6,84.38 46.81,84.38 46.81,83.89
N$30
  Top 0.025: 1.98,80.25 2.23,80.25 2.23,80.86 2.7,80.86 2.7,80.25 2.95,80.25 2.95,81.63 2.7,81.63 2.7,81.07 2.23,81.07 2.23,81.63 1.98,81.63 1.98,80.25
N$31
  Top 0.025: 3.32,80.25 4.22,80.25 4.22,80.46 3.56,80.46 3.56,80.86 4.11,80.86 4.11,81.07 3.56,81.07 3.56,81.43 4.2,81.43 4.2,81.63 3.32,81.63 3.32,80.25
N$32
  Top 0.025: 4.62,80.25 5.51,80.25 5.51,80.46 4.86,80.46 4.86,81.63 4.62,81.63 4.62,80.25
N$33
  Top 0.025: 5.89,80.25 6.78,80.25 6.78,80.46 6.13,80.46 6.13,81.63 5.89,81.63 5.89,80.25
N$34
  Top 0.025: 7.44,80.22 7.64,80.22 7.93,80.41 8.09,80.81 8.09,81.08 7.93,81.47 7.64,81.66 7.44,81.66 7.15,81.47 7,81.08 7,80.81 7.15,80.41 7.44,80.22
N$35
  Top 0.025: 7.59,80.44 7.49,80.44 7.33,80.57 7.25,80.85 7.25,81.04 7.33,81.31 7.49,81.44 7.59,81.44 7.75,81.31 7.83,81.04 7.83,80.85 7.75,80.57 7.59,80.44
N$36
  Top 0.025: 8.99,79.94 9.24,80.04 9.27,80.05 9.19,80.18 9.17,80.17 8.97,80.09 8.82,80.09 8.57,80.27 8.44,80.65 8.44,80.9 8.57,81.29 8.8,81.45 8.94,81.45 9.11,81.35 9.18,81.17 9.18,81.08 9.09,81.07 8.78,80.97 8.63,80.78 8.63,80.67 8.71,80.51 8.86,80.44 8.97,80.44 9.16,80.55 9.17,80.57 9.18,80.57 9.2,80.46 9.33,80.46 9.33,81.18 9.23,81.45 8.97,81.6 8.78,81.6 8.44,81.4 8.26,80.94 8.26,80.62 8.45,80.15 8.79,79.94 8.99,79.94
N$37
  Top 0.025: 8.92,80.59 8.82,80.69 8.82,80.78 9.1,80.92 9.16,80.93 9.16,80.7 9.14,80.69 9,80.59 8.92,80.59
N$38
  Top 0.025: 3.96,77.57 4.26,77.75 4.29,77.78 4.15,77.93 4.13,77.91 3.94,77.79 3.8,77.79 3.59,77.92 3.48,78.2 3.48,78.39 3.59,78.66 3.79,78.8 3.93,78.8 4.11,78.7 4.12,78.69 4.26,78.84 4.24,78.86 3.96,79.01 3.75,79.01 3.41,78.82 3.23,78.42 3.23,78.16 3.41,77.76 3.74,77.57 3.96,77.57
N$39
  Top 0.025: 4.54,77.6 4.79,77.6 4.79,78.14 5,78.14 5.29,77.6 5.57,77.6 5.25,78.18 5.29,78.19 5.52,78.48 5.52,78.66 5.37,78.9 5.1,78.98 4.54,78.98 4.54,77.6
N$40
  Top 0.025: 4.79,78.34 4.79,78.79 5.05,78.79 5.28,78.63 5.28,78.52 5.05,78.34 4.79,78.34
N$41
  Top 0.025: 6.37,77.57 6.63,77.71 6.76,78.03 6.76,78.98 6.52,78.98 6.52,78.03 6.34,77.79 6.22,77.79 6.03,78.03 6.03,78.98 5.79,78.98 5.79,78.03 5.92,77.71 6.19,77.57 6.37,77.57
N$42
  Top 0.025: 7.03,77.6 8.06,77.6 8.06,77.81 7.34,77.81 8.05,78.84 8.05,78.98 7.1,78.98 7.1,78.78 7.75,78.78 7.03,77.75 7.03,77.6
N$43
  Top 0.025: 8.31,77.6 8.52,77.6 8.52,78.3 8.49,78.69 8.49,78.73 8.5,78.73 8.58,78.41 8.74,77.97 8.88,77.97 9.03,78.41 9.12,78.73 9.13,78.73 9.12,78.69 9.09,78.29 9.09,77.6 9.31,77.6 9.31,78.98 9.04,78.98 8.87,78.44 8.81,78.24 8.8,78.24 8.75,78.44 8.58,78.98 8.31,78.98 8.31,77.6
N$44
  Top 0.025: 9.98,77.57 10.18,77.57 10.47,77.76 10.62,78.17 10.62,78.43 10.47,78.83 10.18,79.01 9.98,79.01 9.69,78.83 9.54,78.43 9.54,78.17 9.69,77.76 9.98,77.57
N$45
  Top 0.025: 10.13,77.79 10.03,77.79 9.87,77.92 9.79,78.21 9.79,78.39 9.87,78.67 10.03,78.8 10.13,78.8 10.29,78.67 10.37,78.39 10.37,78.21 10.29,77.92 10.13,77.79
N$46
  Top 0.025: 10.87,77.6 11.11,77.6 11.11,78.33 11.07,78.64 11.07,78.68 11.08,78.68 11.21,78.38 11.57,77.6 11.83,77.6 11.83,78.98 11.59,78.98 11.59,78.27 11.63,77.95 11.63,77.91 11.62,77.91 11.5,78.21 11.13,78.98 10.87,78.98 10.87,77.6
N$47
  Top 0.025: 12.16,77.6 12.41,77.6 12.41,78.14 12.61,78.14 12.91,77.6 13.19,77.6 12.86,78.18 12.9,78.19 13.13,78.48 13.13,78.66 12.99,78.9 12.71,78.98 12.16,78.98 12.16,77.6
N$48
  Top 0.025: 12.41,78.34 12.41,78.79 12.67,78.79 12.89,78.63 12.89,78.52 12.67,78.34 12.41,78.34
N$49
  Top 0.025: 13.43,77.6 13.68,77.6 13.68,78.14 13.88,78.14 14.18,77.6 14.45,77.6 14.13,78.18 14.17,78.19 14.4,78.48 14.4,78.66 14.26,78.9 13.98,78.98 13.43,78.98 13.43,77.6
N$50
  Top 0.025: 13.68,78.34 13.68,78.79 13.94,78.79 14.16,78.63 14.16,78.52 13.94,78.34 13.68,78.34
N$51
  Top 0.025: 14.74,77.6 15.65,77.6 15.65,77.81 14.98,77.81 14.98,78.22 15.53,78.22 15.53,78.42 14.98,78.42 14.98,78.78 15.62,78.78 15.62,78.98 14.74,78.98 14.74,77.6
N$52
  Top 0.025: 16.29,78.34 16.3,78.38 16.41,78.76 16.42,78.8 16.43,78.8 16.43,78.76 16.54,78.38 16.55,78.34 16.6,78.17 16.25,78.17 16.29,78.34
N$53
  Top 0.025: 15.84,77.6 16.08,77.6 16.19,77.98 16.65,77.98 16.76,77.6 17.02,77.6 16.57,78.98 16.28,78.98 15.84,77.6
N$54
  Top 0.025: 17.31,77.6 18.21,77.6 18.21,77.81 17.56,77.81 17.56,78.98 17.31,78.98 17.31,77.6
N$55
  Top 0.025: 19.02,77.57 19.17,77.73 19.17,77.84 19.02,78 18.91,78 18.75,77.84 18.75,77.73 18.91,77.57 19.02,77.57
N$56
  Top 0.025: 19.77,77.6 20.69,77.6 20.69,77.81 20.35,77.81 20.35,78.78 20.69,78.78 20.69,78.98 19.77,78.98 19.77,78.78 20.11,78.78 20.11,77.81 19.77,77.81 19.77,77.6
N$57
  Top 0.025: 21.02,77.6 21.26,77.6 21.26,78.33 21.23,78.64 21.23,78.68 21.36,78.38 21.72,77.6 21.98,77.6 21.98,78.98 21.74,78.98 21.74,78.27 21.78,77.95 21.78,77.91 21.77,77.91 21.65,78.21 21.28,78.98 21.02,78.98 21.02,77.6
N$58
  Top 0.025: 22.39,77.6 22.63,77.6 22.63,78.18 23.18,78.18 23.18,78.38 22.63,78.38 22.63,78.78 23.27,78.78 23.27,78.98 22.39,78.98 22.39,77.6
N$59
  Top 0.025: 23.94,77.57 24.14,77.57 24.43,77.76 24.59,78.17 24.59,78.43 24.43,78.83 24.14,79.01 23.94,79.01 23.65,78.83 23.5,78.43 23.5,78.17 23.65,77.76 23.94,77.57
N$60
  Top 0.025: 24.09,77.79 23.99,77.79 23.83,77.92 23.75,78.21 23.75,78.39 23.83,78.67 23.99,78.8 24.09,78.8 24.25,78.67 24.33,78.39 24.33,78.21 24.25,77.92 24.09,77.79
N$61
  Top 0.025: 3.6,75.69 3.61,75.73 3.72,76.11 3.73,76.15 3.74,76.11 3.85,75.73 3.85,75.69 3.9,75.52 3.56,75.52 3.6,75.69
N$62
  Top 0.025: 3.14,74.96 3.39,74.96 3.5,75.33 3.96,75.33 4.06,74.96 4.33,74.96 3.88,76.34 3.59,76.34 3.14,74.96
N$63
  Top 0.025: 4.52,74.96 4.76,74.96 4.76,75.68 4.73,75.99 4.73,76.03 4.86,75.73 5.22,74.96 5.48,74.96 5.48,76.34 5.25,76.34 5.25,75.62 5.28,75.3 5.28,75.27 5.27,75.27 5.15,75.56 4.78,76.34 4.52,76.34 4.52,74.96
N$64
  Top 0.025: 6.17,74.93 6.37,74.93 6.67,75.12 6.82,75.52 6.82,75.79 6.67,76.18 6.37,76.37 6.17,76.37 5.88,76.18 5.73,75.79 5.73,75.52 5.88,75.12 6.17,74.93
N$65
  Top 0.025: 6.32,75.14 6.22,75.14 6.06,75.28 5.98,75.56 5.98,75.75 6.06,76.02 6.22,76.15 6.32,76.15 6.48,76.02 6.56,75.75 6.56,75.56 6.48,75.28 6.32,75.14
N$66
  Top 0.025: 7.42,74.96 7.66,74.96 7.66,76.14 8.1,76.14 8.1,76.34 6.98,76.34 6.98,76.14 7.42,76.14 7.42,74.96
N$67
  Top 0.025: 8.33,74.96 8.57,74.96 8.57,75.57 9.05,75.57 9.05,74.96 9.29,74.96 9.29,76.34 9.05,76.34 9.05,75.78 8.57,75.78 8.57,76.34 8.33,76.34 8.33,74.96
N$68
  Top 0.025: 9.67,74.96 10.57,74.96 10.57,75.17 9.91,75.17 9.91,75.57 10.45,75.57 10.45,75.78 9.91,75.78 9.91,76.14 10.55,76.14 10.55,76.34 9.67,76.34 9.67,74.96
N$69
  Top 0.025: 10.89,74.96 11.14,74.96 11.14,75.5 11.34,75.5 11.64,74.96 11.92,74.96 11.59,75.53 11.63,75.55 11.87,75.84 11.87,76.01 11.72,76.25 11.45,76.34 10.89,76.34 10.89,74.96
N$70
  Top 0.025: 11.14,75.69 11.14,76.14 11.4,76.14 11.62,75.98 11.62,75.87 11.4,75.69 11.14,75.69
N$71
  Top 0.025: 12.2,74.96 13.11,74.96 13.11,75.17 12.45,75.17 12.45,75.57 12.99,75.57 12.99,75.78 12.45,75.78 12.45,76.14 13.09,76.14 13.09,76.34 12.2,76.34 12.2,74.96
N$72
  Top 0.025: 13.33,74.96 13.59,74.96 13.77,75.28 13.77,75.3 13.86,75.49 13.87,75.51 13.88,75.51 13.89,75.49 13.99,75.3 14,75.28 14.17,74.96 14.45,74.96 14.04,75.66 14.42,76.34 14.16,76.34 14,76.03 13.99,76.02 13.92,75.84 13.91,75.82 13.9,75.82 13.89,75.84 13.8,76.02 13.79,76.03 13.63,76.34 13.35,76.34 13.74,75.67 13.33,74.96
N$73
  Top 0.025: 14.71,74.96 14.95,74.96 14.95,75.46 15.26,75.46 15.54,75.57 15.69,75.83 15.69,76 15.54,76.25 15.26,76.34 14.71,76.34 14.71,74.96
N$74
  Top 0.025: 14.95,75.66 14.95,76.14 15.22,76.14 15.45,75.97 15.45,75.85 15.22,75.66 14.95,75.66
N$75
  Top 0.025: 16.01,74.96 16.91,74.96 16.91,75.17 16.25,75.17 16.25,75.57 16.8,75.57 16.8,75.78 16.25,75.78 16.25,76.14 16.89,76.14 16.89,76.34 16.01,76.34 16.01,74.96
N$76
  Top 0.025: 17.24,74.96 17.48,74.96 17.48,75.5 17.69,75.5 17.99,74.96 18.26,74.96 17.94,75.53 17.98,75.55 18.21,75.84 18.21,76.01 18.06,76.25 17.79,76.34 17.24,76.34 17.24,74.96
N$77
  Top 0.025: 17.48,75.69 17.48,76.14 17.75,76.14 17.97,75.98 17.97,75.87 17.75,75.69 17.48,75.69
N$78
  Top 0.025: 18.51,74.96 19.42,74.96 19.42,75.17 19.08,75.17 19.08,76.14 19.42,76.14 19.42,76.34 18.51,76.34 18.51,76.14 18.84,76.14 18.84,75.17 18.51,75.17 18.51,74.96
N$79
  Top 0.025: 19.74,74.96 19.95,74.96 19.95,75.65 19.92,76.05 19.91,76.08 19.92,76.08 20.01,75.76 20.16,75.32 20.3,75.32 20.45,75.76 20.55,76.08 20.55,76.05 20.51,75.65 20.51,74.96 20.73,74.96 20.73,76.34 20.46,76.34 20.29,75.8 20.24,75.59 20.23,75.59 20.17,75.8 20.01,76.34 19.74,76.34 19.74,74.96
N$80
  Top 0.025: 21.09,74.96 21.99,74.96 21.99,75.17 21.33,75.17 21.33,75.57 21.88,75.57 21.88,75.78 21.33,75.78 21.33,76.14 21.97,76.14 21.97,76.34 21.09,76.34 21.09,74.96
N$81
  Top 0.025: 22.29,74.96 22.53,74.96 22.53,75.68 22.5,75.99 22.5,76.03 22.63,75.73 22.99,74.96 23.25,74.96 23.25,76.34 23.01,76.34 23.01,75.62 23.05,75.3 23.05,75.27 23.04,75.27 22.92,75.56 22.55,76.34 22.29,76.34 22.29,74.96
N$82
  Top 0.025: 23.92,74.96 24.16,74.96 24.16,76.14 24.6,76.14 24.6,76.34 23.48,76.34 23.48,76.14 23.92,76.14 23.92,74.96
N$83
  Top 0.025: 25.26,74.93 25.36,74.93 25.52,75.09 25.52,75.2 25.36,75.36 25.26,75.36 25.1,75.2 25.1,75.09 25.26,74.93
N$84
  Top 0.025: 26.8,74.93 27.11,75.1 27.14,75.13 27,75.28 26.98,75.26 26.78,75.14 26.64,75.14 26.43,75.28 26.32,75.56 26.32,75.74 26.43,76.02 26.64,76.15 26.77,76.15 26.95,76.06 26.97,76.04 27.11,76.19 27.09,76.21 26.8,76.37 26.6,76.37 26.25,76.17 26.07,75.78 26.07,75.51 26.25,75.11 26.58,74.93 26.8,74.93
N$85
  Top 0.025: 27.75,74.93 27.95,74.93 28.24,75.12 28.39,75.52 28.39,75.79 28.24,76.18 27.95,76.37 27.75,76.37 27.46,76.18 27.31,75.79 27.31,75.52 27.46,75.12 27.75,74.93
N$86
  Top 0.025: 27.9,75.14 27.79,75.14 27.64,75.28 27.55,75.56 27.55,75.75 27.64,76.02 27.79,76.15 27.9,76.15 28.06,76.02 28.14,75.75 28.14,75.56 28.06,75.28 27.9,75.14
N$87
  Top 0.025: 28.62,74.96 28.83,74.96 28.83,75.65 28.8,76.05 28.8,76.08 28.89,75.76 29.05,75.32 29.18,75.32 29.34,75.76 29.43,76.08 29.44,76.08 29.43,76.05 29.4,75.65 29.4,74.96 29.61,74.96 29.61,76.34 29.34,76.34 29.18,75.8 29.12,75.59 29.11,75.59 29.06,75.8 28.89,76.34 28.62,76.34 28.62,74.96
N$88
  Top 0.025: 39.1,80.25 40.01,80.25 40.01,80.46 39.34,80.46 39.34,80.86 39.89,80.86 39.89,81.07 39.34,81.07 39.34,81.43 39.98,81.43 39.98,81.63 39.1,81.63 39.1,80.25
N$89
  Top 0.025: 40.3,80.25 40.54,80.25 40.54,80.97 40.51,81.28 40.51,81.32 40.52,81.32 40.64,81.02 41.01,80.25 41.26,80.25 41.26,81.63 41.03,81.63 41.03,80.91 41.06,80.59 41.06,80.56 41.05,80.56 40.93,80.85 40.56,81.63 40.3,81.63 40.3,80.25
N$90
  Top 0.025: 42.25,80.22 42.54,80.36 42.56,80.39 42.56,81 42.1,81 42.1,80.79 42.34,80.79 42.34,80.5 42.33,80.48 42.2,80.44 42.08,80.44 41.87,80.57 41.78,80.85 41.78,81.03 41.88,81.31 42.08,81.44 42.21,81.44 42.39,81.35 42.41,81.33 42.54,81.48 42.52,81.5 42.24,81.66 42.03,81.66 41.7,81.47 41.52,81.07 41.52,80.8 41.7,80.4 42.03,80.22 42.25,80.22
N$91
  Top 0.025: 42.87,80.25 43.78,80.25 43.78,80.46 43.44,80.46 43.44,81.43 43.78,81.43 43.78,81.63 42.87,81.63 42.87,81.43 43.2,81.43 43.2,80.46 42.87,80.46 42.87,80.25
N$92
  Top 0.025: 44.11,80.25 44.35,80.25 44.35,80.97 44.32,81.28 44.32,81.32 44.45,81.02 44.81,80.25 45.07,80.25 45.07,81.63 44.84,81.63 44.84,80.91 44.87,80.59 44.87,80.56 44.86,80.56 44.74,80.85 44.37,81.63 44.11,81.63 44.11,80.25
N$93
  Top 0.025: 45.45,80.25 46.35,80.25 46.35,80.46 45.69,80.46 45.69,80.86 46.24,80.86 46.24,81.07 45.69,81.07 45.69,81.43 46.33,81.43 46.33,81.63 45.45,81.63 45.45,80.25
N$94
  Top 0.025: 46.72,80.25 47.62,80.25 47.62,80.46 46.96,80.46 46.96,80.86 47.51,80.86 47.51,81.07 46.96,81.07 46.96,81.43 47.6,81.43 47.6,81.63 46.72,81.63 46.72,80.25
N$95
  Top 0.025: 47.94,80.25 48.19,80.25 48.19,80.79 48.39,80.79 48.69,80.25 48.97,80.25 48.64,80.83 48.68,80.84 48.92,81.13 48.92,81.3 48.77,81.54 48.5,81.63 47.94,81.63 47.94,80.25
N$96
  Top 0.025: 48.19,80.99 48.19,81.43 48.45,81.43 48.67,81.28 48.67,81.16 48.45,80.99 48.19,80.99
N$97
  Top 0.025: 36.52,77.6 36.77,77.6 36.77,78.14 36.97,78.14 37.27,77.6 37.55,77.6 37.22,78.18 37.26,78.19 37.49,78.48 37.49,78.66 37.35,78.9 37.07,78.98 36.52,78.98 36.52,77.6
N$98
  Top 0.025: 36.77,78.34 36.77,78.79 37.03,78.79 37.25,78.63 37.25,78.52 37.03,78.34 36.77,78.34
N$99
  Top 0.025: 38.34,77.57 38.64,77.76 38.79,78.17 38.79,78.43 38.64,78.83 38.34,79.01 38.15,79.01 37.86,78.83 37.71,78.43 37.71,78.17 37.86,77.76 38.15,77.57 38.34,77.57
N$100
  Top 0.025: 38.3,77.79 38.19,77.79 38.03,77.92 37.95,78.21 37.95,78.39 38.03,78.67 38.19,78.8 38.3,78.8 38.46,78.67 38.54,78.39 38.54,78.21 38.46,77.92 38.3,77.79
N$101
  Top 0.025: 39.06,77.6 39.63,77.6 39.91,77.7 40.06,77.93 40.06,78.09 39.8,78.33 39.75,78.33 39.75,78.35 39.79,78.36 39.98,78.57 39.98,78.71 39.85,78.91 39.58,78.98 39.06,78.98 39.06,77.6
N$102
  Top 0.025: 39.31,78.42 39.31,78.79 39.54,78.79 39.74,78.66 39.74,78.57 39.54,78.42 39.31,78.42
N$103
  Top 0.025: 39.31,77.8 39.31,78.23 39.58,78.23 39.81,78.08 39.81,77.97 39.58,77.8 39.31,77.8
N$104
  Top 0.025: 40.69,77.57 40.88,77.57 41.18,77.76 41.33,78.17 41.33,78.43 41.18,78.83 40.88,79.01 40.69,79.01 40.39,78.83 40.24,78.43 40.24,78.17 40.39,77.76 40.69,77.57
N$105
  Top 0.025: 40.84,77.79 40.73,77.79 40.57,77.92 40.49,78.21 40.49,78.39 40.57,78.67 40.73,78.8 40.84,78.8 41,78.67 41.08,78.39 41.08,78.21 41,77.92 40.84,77.79
N$106
  Top 0.025: 41.93,77.6 42.17,77.6 42.17,78.78 42.62,78.78 42.62,78.98 41.5,78.98 41.5,78.78 41.93,78.78 41.93,77.6
N$107
  Top 0.025: 42.87,77.6 43.78,77.6 43.78,77.81 43.44,77.81 43.44,78.78 43.78,78.78 43.78,78.98 42.87,78.98 42.87,78.78 43.2,78.78 43.2,77.81 42.87,77.81 42.87,77.6
N$108
  Top 0.025: 44.6,77.57 44.82,77.57 45.12,77.75 45.15,77.78 45.01,77.93 44.99,77.91 44.8,77.79 44.66,77.79 44.44,77.92 44.34,78.2 44.34,78.39 44.44,78.66 44.65,78.8 44.79,78.8 44.97,78.7 44.98,78.69 45.12,78.84 45.1,78.86 44.82,79.01 44.61,79.01 44.27,78.82 44.09,78.42 44.09,78.16 44.27,77.76 44.6,77.57
N$109
  Top 0.025: 45.4,77.6 46.32,77.6 46.32,77.81 45.98,77.81 45.98,78.78 46.32,78.78 46.32,78.98 45.4,78.98 45.4,78.78 45.74,78.78 45.74,77.81 45.4,77.81 45.4,77.6
N$110
  Top 0.025: 47.23,77.57 47.51,77.7 47.65,77.92 47.65,78.08 47.39,78.34 47.34,78.36 47.16,78.44 47.13,78.45 46.93,78.59 46.93,78.67 47.09,78.8 47.23,78.8 47.45,78.7 47.48,78.68 47.6,78.84 47.58,78.86 47.27,79.01 47.08,79.01 46.81,78.9 46.68,78.69 46.68,78.56 46.77,78.38 46.94,78.27 46.98,78.25 47.16,78.17 47.2,78.16 47.4,78.01 47.4,77.92 47.21,77.79 47.05,77.79 46.79,77.92 46.76,77.95 46.62,77.78 46.65,77.75 47.02,77.57 47.23,77.57
N$111
  Top 0.025: 48.28,77.6 48.52,77.6 48.52,78.78 48.96,78.78 48.96,78.98 47.84,78.98 47.84,78.78 48.28,78.78 48.28,77.6
N$112
  Top 0.025: 42.83,74.96 43.04,74.96 43.04,75.65 43.01,76.05 43,76.08 43.01,76.08 43.1,75.76 43.25,75.32 43.39,75.32 43.54,75.76 43.64,76.08 43.64,76.05 43.6,75.65 43.6,74.96 43.82,74.96 43.82,76.34 43.55,76.34 43.38,75.8 43.33,75.59 43.32,75.59 43.26,75.8 43.1,76.34 42.83,76.34 42.83,74.96
N$113
  Top 0.025: 44.46,75.69 44.47,75.73 44.58,76.11 44.59,76.15 44.6,76.11 44.7,75.73 44.71,75.69 44.76,75.52 44.41,75.52 44.46,75.69
N$114
  Top 0.025: 44,74.96 44.25,74.96 44.36,75.33 44.82,75.33 44.92,74.96 45.19,74.96 44.74,76.34 44.45,76.34 44,74.96
N$115
  Top 0.025: 45.4,74.96 45.65,74.96 45.65,75.36 45.85,75.61 46.2,74.96 46.47,74.96 46,75.81 46.42,76.34 46.15,76.34 45.66,75.71 45.65,75.71 45.65,76.34 45.4,76.34 45.4,74.96
N$116
  Top 0.025: 46.72,74.96 47.62,74.96 47.62,75.17 46.96,75.17 46.96,75.57 47.51,75.57 47.51,75.78 46.96,75.78 46.96,76.14 47.6,76.14 47.6,76.34 46.72,76.34 46.72,74.96
N$117
  Top 0.025: 47.94,74.96 48.19,74.96 48.19,75.5 48.39,75.5 48.69,74.96 48.97,74.96 48.64,75.53 48.68,75.55 48.92,75.84 48.92,76.01 48.77,76.25 48.5,76.34 47.94,76.34 47.94,74.96
N$118
  Top 0.025: 48.19,75.69 48.19,76.14 48.45,76.14 48.67,75.98 48.67,75.87 48.45,75.69 48.19,75.69

## Text on the board
Top: v0.3
bKeepout: ABC | ABC | ABC | ABC
tDocu: v0.3